# Altium schematic sheet Peripheral.SchDoc
size A4
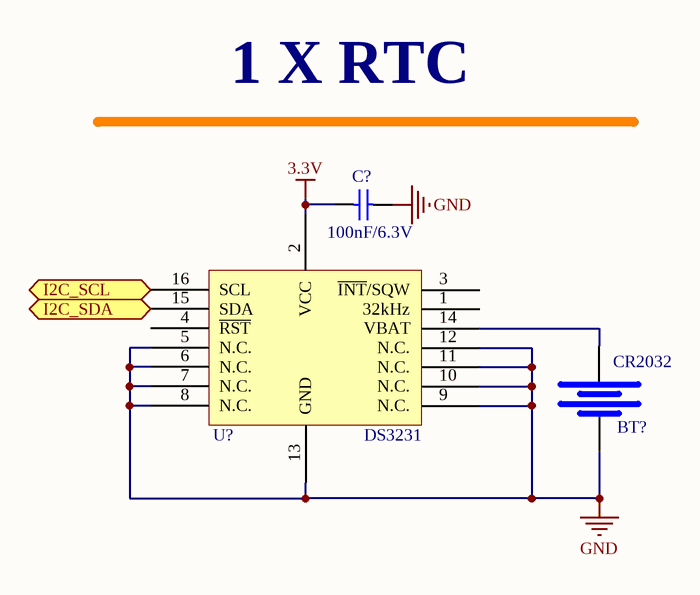
[diagram p0: Peripheral.SchDoc]

## Parts
BT?  CR2032  [CR2032]
C?  100nF/6.3V  [CAP0603W]
U?  DS3231  [SOIC16]

## Ports
I2C_SCL, I2C_SDA

## Nets
3.3V: C?.1 U?.2(VCC)
GND: BT?.2(-) C?.2 U?.5(N.C.) U?.6(N.C.) U?.7(N.C.) U?.8(N.C.) U?.9(N.C.) U?.10(N.C.) U?.11(N.C.) U?.12(N.C.) U?.13(GND)
I2C_SCL: U?.16(SCL) ; port I2C_SCL
I2C_SDA: U?.15(SDA) ; port I2C_SDA
NetBT?_1: BT?.1(+) U?.14(VBAT)

Not connected (* = marked no-connect by the designer): U? 1(32kHz) 3(~{INT}/SQW) 4(~{RST})

## Notes on the sheet
- 1 X RTC

## Library data of the parts
BT? = BATTERY_CR2032: BATTERY CR2032 HORIZONTAL 3PIN
C? = CAP1: CAPACITOR 0603 Case; Value: 100nF; Published: 8-Jun-2000; LatestRevisionDate: 17-Jul-2002; LatestRevisionNote: Re-released for DXP Platform.; PackageReference: C1206; Publisher: Altium Limited
U? = RTC_DS3231: IC DS3231SN RTC W/TCXO 16-SOIC MAXIM